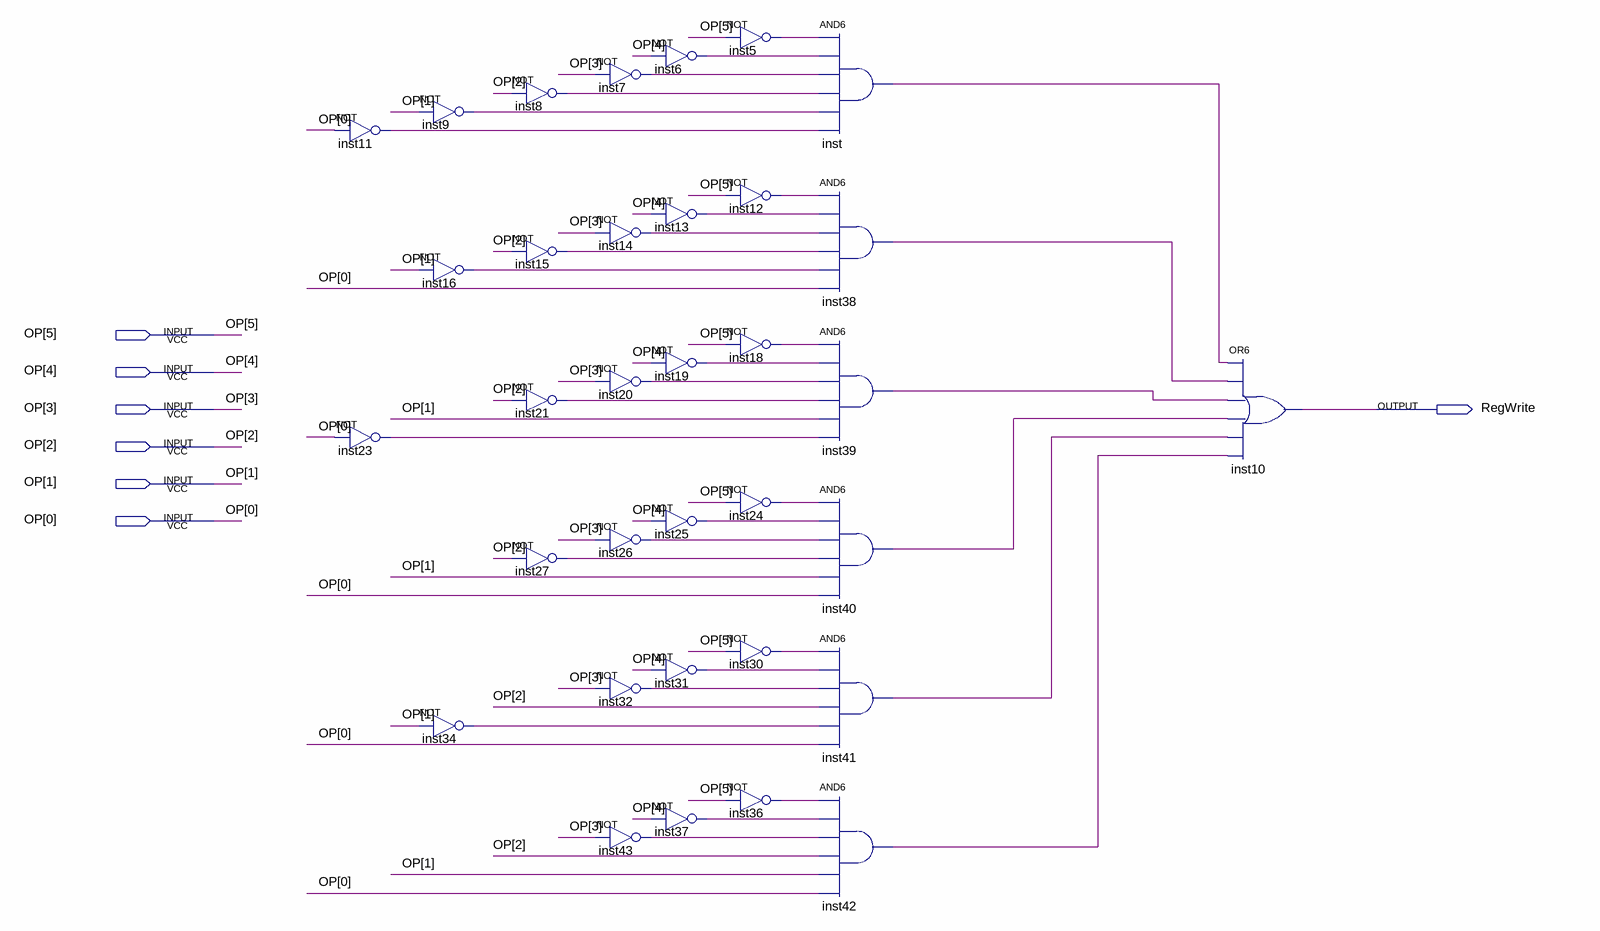
[diagram p0: schematic sheet]
// Quartus schematic RegWrite.bdf as structural Verilog: 34 symbols, 7 pins
module RegWrite (
  input  [5:0] OP,
  output RegWrite
);

  wire inst5_out, inst6_out, inst7_out, inst8_out, inst9_out, inst11_out, inst12_out, inst13_out, inst14_out,
       inst15_out, inst16_out, inst18_out, inst19_out, inst20_out, inst21_out, inst23_out, inst24_out,
       inst25_out, inst26_out, inst27_out, inst30_out, inst31_out, inst32_out, inst34_out, inst36_out,
       inst37_out, inst38_out, inst39_out, inst40_out, inst41_out, inst42_out, inst43_out, inst_out;

  not inst11 (inst11_out, OP[0]);
  not inst23 (inst23_out, OP[0]);
  not inst9 (inst9_out, OP[1]);
  not inst16 (inst16_out, OP[1]);
  not inst34 (inst34_out, OP[1]);
  not inst8 (inst8_out, OP[2]);
  not inst15 (inst15_out, OP[2]);
  not inst21 (inst21_out, OP[2]);
  not inst27 (inst27_out, OP[2]);
  not inst6 (inst6_out, OP[4]);
  not inst7 (inst7_out, OP[3]);
  not inst13 (inst13_out, OP[4]);
  not inst14 (inst14_out, OP[3]);
  not inst19 (inst19_out, OP[4]);
  not inst20 (inst20_out, OP[3]);
  not inst25 (inst25_out, OP[4]);
  not inst26 (inst26_out, OP[3]);
  not inst31 (inst31_out, OP[4]);
  not inst32 (inst32_out, OP[3]);
  not inst37 (inst37_out, OP[4]);
  not inst43 (inst43_out, OP[3]);
  not inst5 (inst5_out, OP[5]);
  not inst12 (inst12_out, OP[5]);
  not inst18 (inst18_out, OP[5]);
  not inst24 (inst24_out, OP[5]);
  not inst30 (inst30_out, OP[5]);
  not inst36 (inst36_out, OP[5]);
  and inst (inst_out, inst5_out, inst6_out, inst7_out, inst8_out, inst9_out, inst11_out);
  and inst38 (inst38_out, inst12_out, inst13_out, inst14_out, inst15_out, inst16_out, OP[0]);
  and inst39 (inst39_out, inst18_out, inst19_out, inst20_out, inst21_out, OP[1], inst23_out);
  and inst40 (inst40_out, inst24_out, inst25_out, inst26_out, inst27_out, OP[1], OP[0]);
  and inst41 (inst41_out, inst30_out, inst31_out, inst32_out, OP[2], inst34_out, OP[0]);
  and inst42 (inst42_out, inst36_out, inst37_out, inst43_out, OP[2], OP[1], OP[0]);
  or inst10 (RegWrite, inst_out, inst38_out, inst39_out, inst40_out, inst41_out, inst42_out);
endmodule
